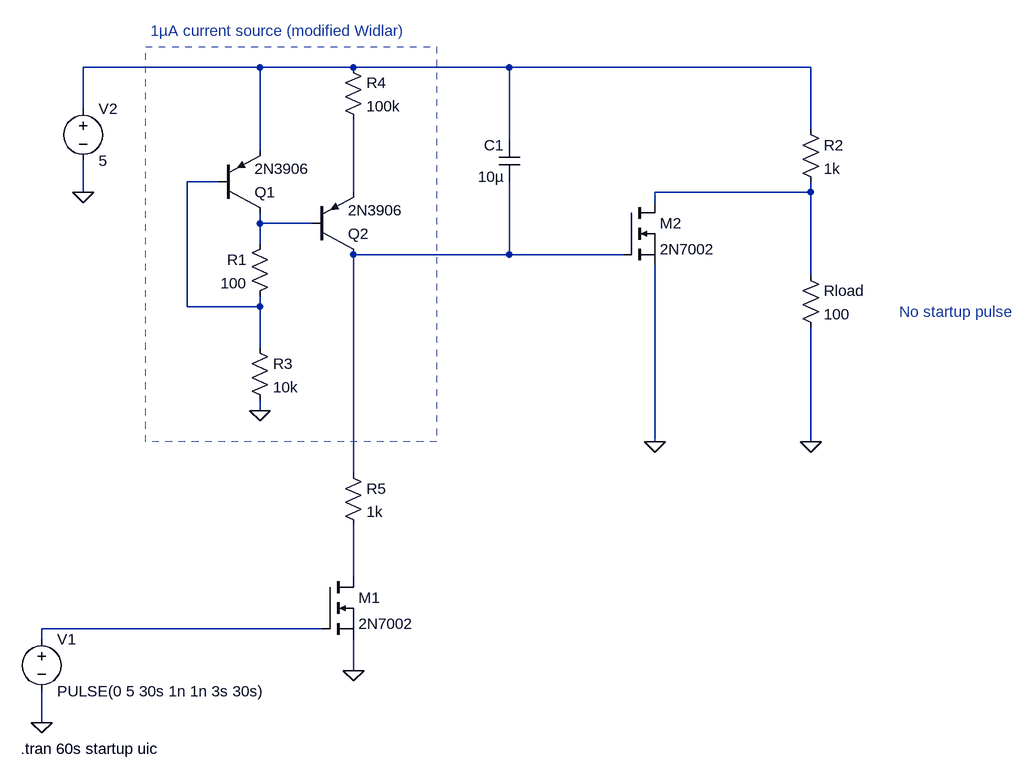
[diagram p0: schematic monostable2.asc]
monostable2.asc, the LTspice schematic file:
Version 4
SHEET 1 2056 744
WIRE 560 -512 288 -512
WIRE 704 -512 560 -512
WIRE 944 -512 704 -512
WIRE 1408 -512 944 -512
WIRE 288 -448 288 -512
WIRE 1408 -416 1408 -512
WIRE 944 -400 944 -512
WIRE 560 -384 560 -512
WIRE 496 -336 448 -336
WIRE 288 -320 288 -368
WIRE 704 -320 704 -432
WIRE 1408 -320 1408 -336
WIRE 1408 -320 1168 -320
WIRE 1168 -304 1168 -320
WIRE 560 -272 560 -288
WIRE 640 -272 560 -272
WIRE 560 -240 560 -272
WIRE 944 -224 944 -336
WIRE 944 -224 704 -224
WIRE 1120 -224 944 -224
WIRE 1408 -192 1408 -320
WIRE 448 -144 448 -336
WIRE 560 -144 560 -160
WIRE 560 -144 448 -144
WIRE 560 -80 560 -144
WIRE 560 16 560 0
WIRE 1168 64 1168 -208
WIRE 1408 64 1408 -112
WIRE 704 112 704 -224
WIRE 704 272 704 192
WIRE 656 352 224 352
WIRE 224 368 224 352
WIRE 704 416 704 368
WIRE 224 496 224 448
FLAG 704 416 0
FLAG 1168 64 0
FLAG 288 -320 0
FLAG 224 496 0
FLAG 560 16 0
FLAG 1408 64 0
SYMBOL nmos 656 272 R0
SYMATTR InstName M1
SYMATTR Value 2N7002
SYMBOL nmos 1120 -304 R0
SYMATTR InstName M2
SYMATTR Value 2N7002
SYMBOL voltage 224 352 R0
WINDOW 123 0 0 Left 0
WINDOW 39 0 0 Left 0
SYMATTR InstName V1
SYMATTR Value PULSE(0 5 30s 1n 1n 3s 30s)
SYMBOL voltage 288 -464 R0
SYMATTR InstName V2
SYMATTR Value 5
SYMBOL cap 960 -336 R180
WINDOW 0 24 56 Left 2
WINDOW 3 24 8 Left 2
SYMATTR InstName C1
SYMATTR Value 10µ
SYMBOL res 1392 -432 R0
SYMATTR InstName R2
SYMATTR Value 1k
SYMBOL pnp 496 -288 M180
SYMATTR InstName Q1
SYMATTR Value 2N3906
SYMBOL pnp 640 -224 M180
SYMATTR InstName Q2
SYMATTR Value 2N3906
SYMBOL res 576 -256 M0
SYMATTR InstName R1
SYMATTR Value 100
SYMBOL res 544 -96 R0
SYMATTR InstName R3
SYMATTR Value 10k
SYMBOL res 688 -528 R0
SYMATTR InstName R4
SYMATTR Value 100k
SYMBOL res 688 96 R0
SYMATTR InstName R5
SYMATTR Value 1k
SYMBOL res 1392 -208 R0
SYMATTR InstName Rload
SYMATTR Value 100
TEXT 192 536 Left 2 !.tran 60s startup uic
TEXT 392 -568 Left 2 ;1µA current source (modified Widlar)
TEXT 1544 -136 Left 2 ;No startup pulse
RECTANGLE Normal 832 64 384 -544 2

The netlist it stands for:
* monostable2.asc
M1 N007 N008 0 0 2N7002
M2 N004 N006 0 0 2N7002
V1 N008 0 PULSE(0 5 30s 1n 1n 3s 30s)
V2 N001 0 5
C1 N006 N001 10µ
R2 N001 N004 1k
Q1 N005 N002 N001 0 2N3906
Q2 N006 N005 N003 0 2N3906
R1 N005 N002 100
R3 N002 0 10k
R4 N001 N003 100k
R5 N006 N007 1k
Rload N004 0 100
.model NPN NPN
.model PNP PNP
.lib standard.bjt
.model NMOS NMOS
.model PMOS PMOS
.lib standard.mos
.tran 60s startup uic
* 1µA current source (modified Widlar)
* No startup pulse
.backanno
.end